# EAGLE schematic 217_ambientlight (EAGLE 7.6.0)
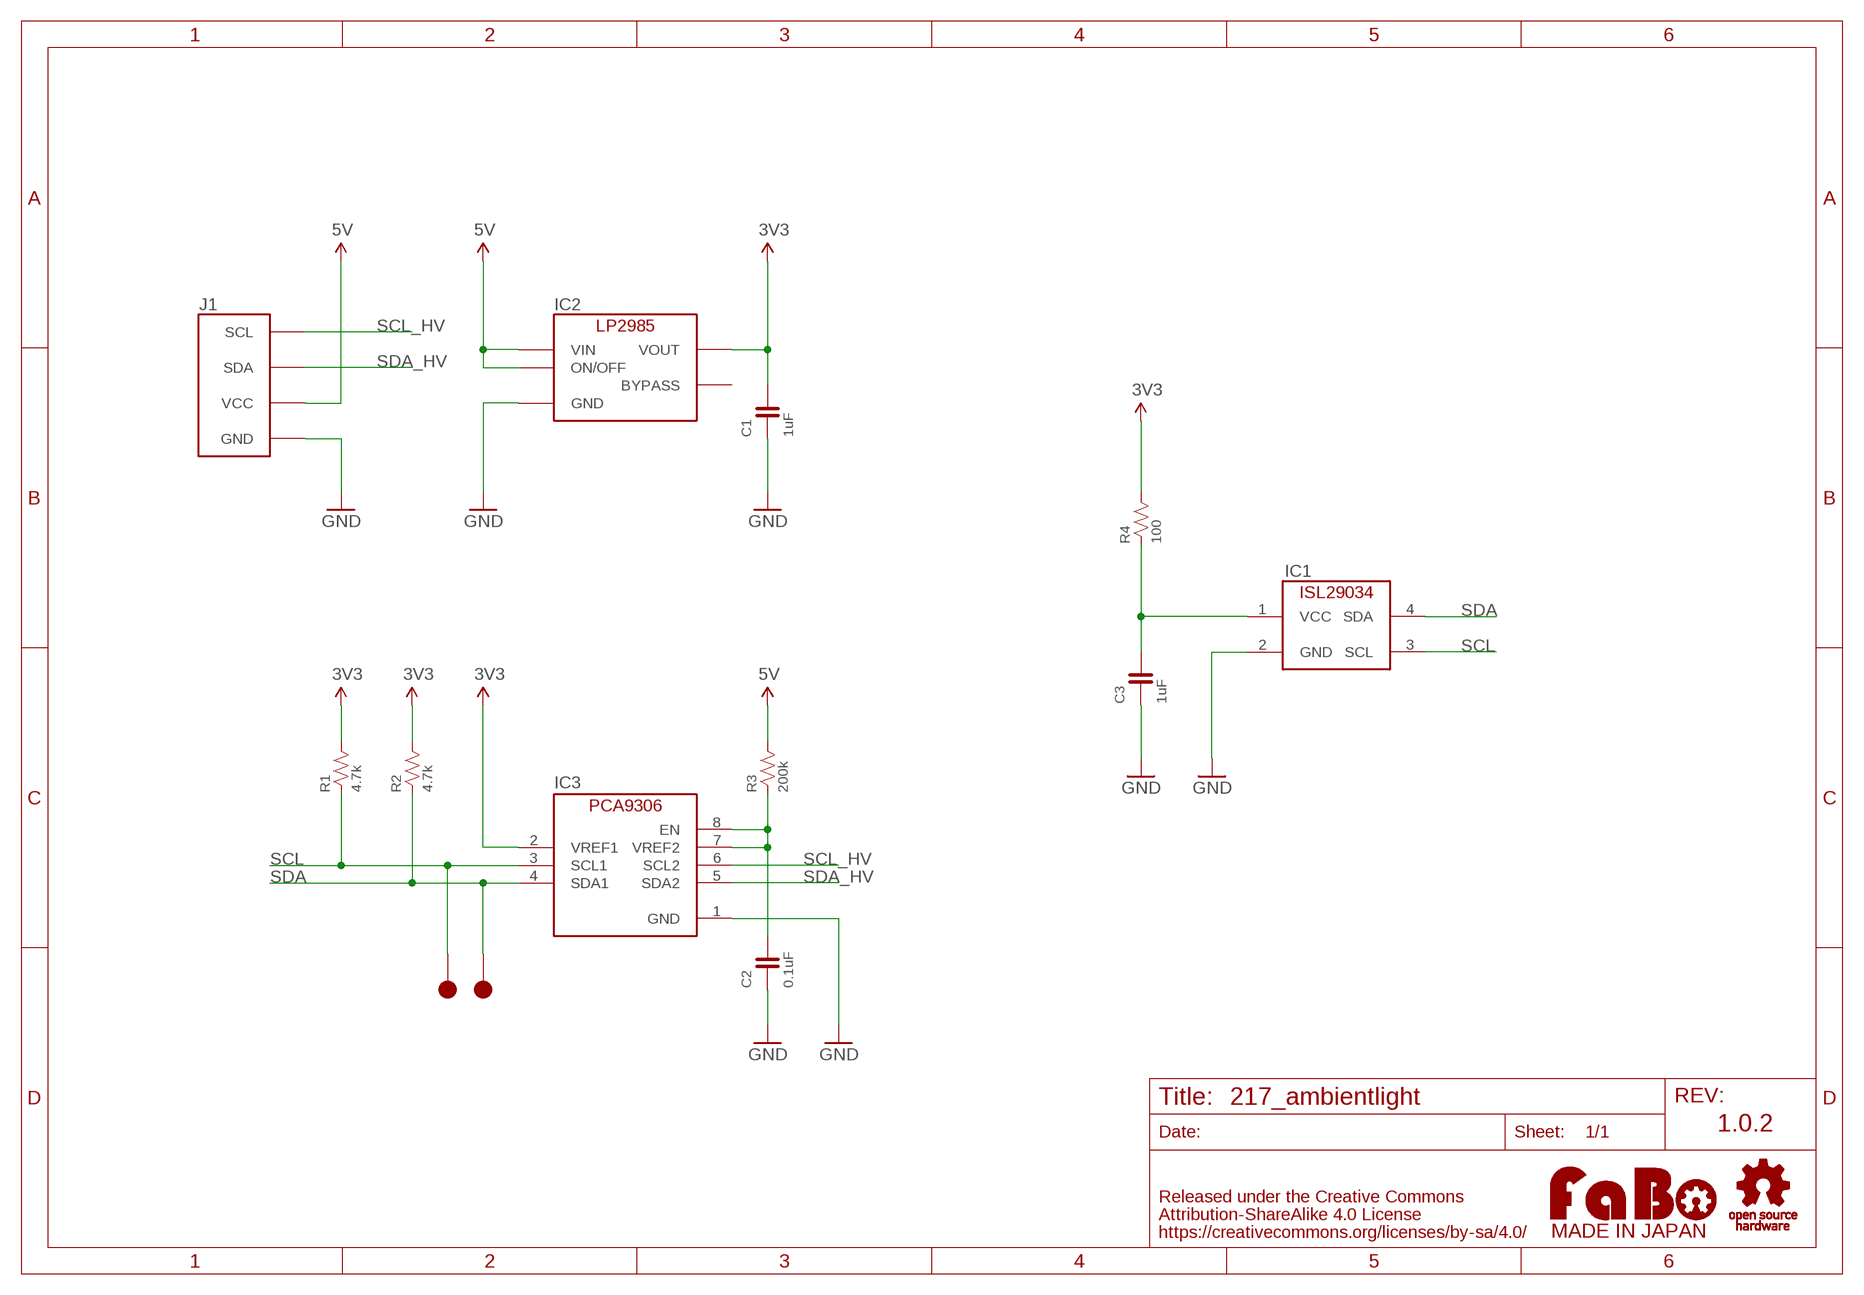
[diagram p0: schematic, sheet 1]

## Parts
C1  1uF  CAPACITOR-0603  [0603]
C2  0.1uF  CAPACITOR-0603  [0603]
C3  1uF  CAPACITOR-0603  [0603]
IC1  IN-ISL29034  [INTERSIL-ISL29034]
IC2  LP2985-33DBV  [SOT-23-5]
IC3  PCA9306GM  [XQFN8]
J1  FABO_BRICK_I2C  [FABO_BRICK_I2C]
R1  4.7k  RESISTOR-0603  [0603]
R2  4.7k  RESISTOR-0603  [0603]
R3  200k  RESISTOR-0603  [0603]
R4  100  RESISTOR-0603  [0603]
TP1  TP-15  [TP-15]
TP2  TP-15  [TP-15]
U$2  LOGO_OSHW-M_BOTTOM  [LOGO_OSHW_M_BOTTOM]
U$3  LOGO_FABO-M  [LOGO_FABO_MS]

## Nets
3V3: C1.2 IC2.5(VOUT) IC3.2(VREF1) R1.2 R2.2 R4.2
5V: IC2.1(VIN) IC2.3(ON/OFF) J1.VCC R3.2
GND: C1.1 C2.1 C3.1 IC1.2(GND) IC2.2(GND) IC3.1(GND) J1.GND
N$2: C2.2 IC3.7(VREF2) IC3.8(EN) R3.1
SCL: IC1.3(SCL) IC3.3(SCL1) R1.1 TP2.1
SCL_HV: IC3.6(SCL2) J1.SCL
SDA: IC1.4(SDA) IC3.4(SDA1) R2.1 TP1.1
SDA_HV: IC3.5(SDA2) J1.SDA
VCC: C3.2 IC1.1(VCC) R4.1
Unconnected: IC2.4(BYPASS)

## Notes on the sheet
- 1.0.2

## Library data of the parts
C1-C3 = FaBo-Capacitor:CAPACITOR: CAPACITOR
IC1 = FaBo-Mems:IN-ISL29034
IC2 = FaBo-Supply:LP2985: LP2985
IC3 = FaBo-LevelTranslator:PCA9306
J1 = FaBo-Template:FABO_BRICK_I2C: FaBo Brick I2C
R1-R4 = FaBo-Resistors:RESISTOR: RESISTOR
TP1 TP2 = FaBo-Supply:TP
U$2 = FaBo-etc:LOGO_OSHW
U$3 = FaBo-etc:LOGO_FABO